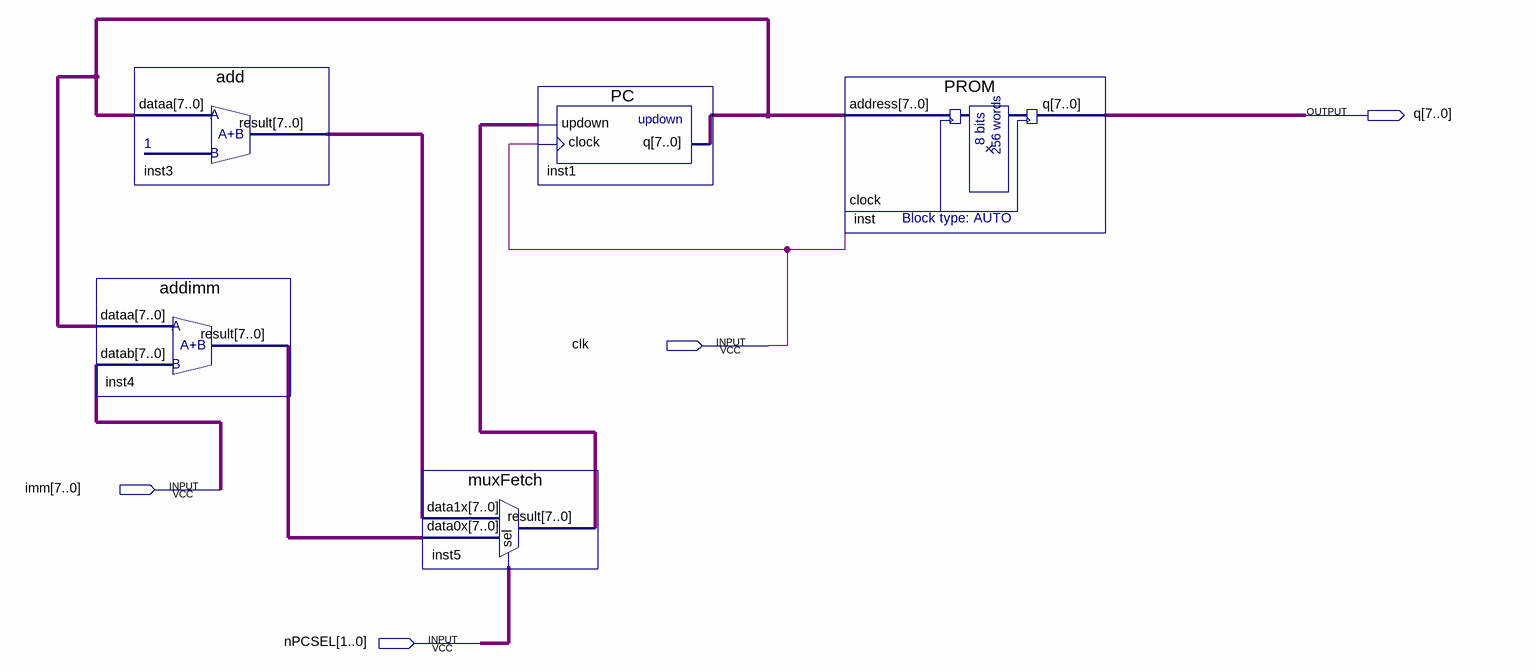
[diagram p0: schematic sheet]
// Quartus schematic memoireROM.bdf as structural Verilog: 5 symbols, 4 pins
module memoireROM (
  input  clk,
  input  [7:0] imm,
  input  [1:0] nPCSEL,
  output [7:0] q
);

  wire [7:0] inst1_q, inst3_result, inst4_result, inst5_result;

  addimm inst4 (.dataa(inst1_q), .datab(imm), .result(inst4_result));
  add inst3 (.dataa(inst1_q), .result(inst3_result));
  muxFetch inst5 (.data1x(inst3_result), .data0x(inst4_result), .sel(nPCSEL), .result(inst5_result));
  PC inst1 (.updown(inst5_result), .clock(clk), .q(inst1_q));
  PROM inst (.address(inst1_q), .clock(clk), .q(q));
endmodule
